# EasyEDA Pro project ax08_doc.eprj, board sequencer
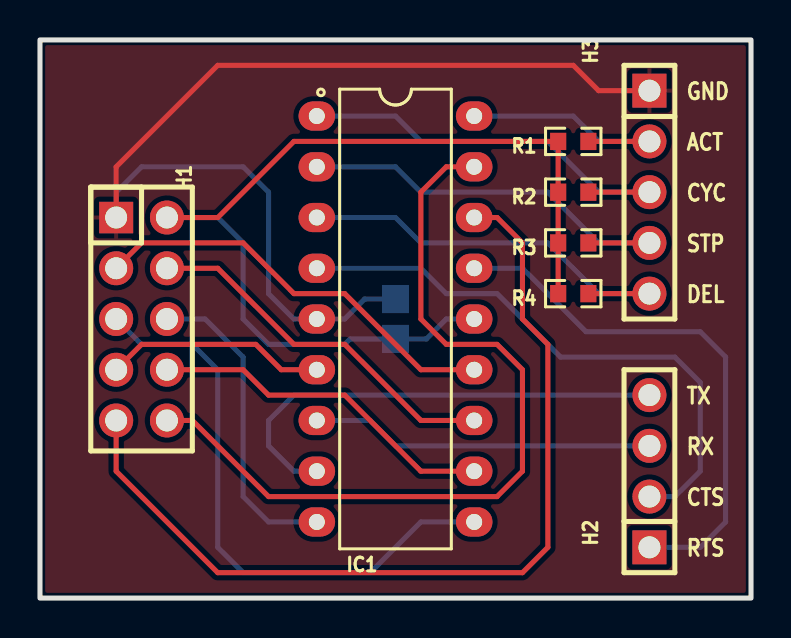
[diagram p26: board, top side]
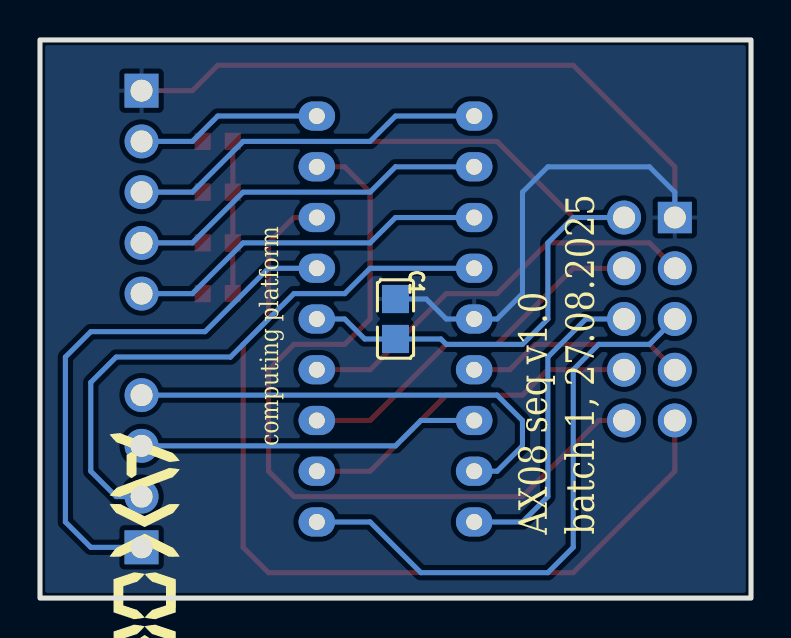
[diagram p27: board, bottom side, seen from below]

Outline 35.56 x 27.94 mm; copper layers: Top Layer, Bottom Layer. Coordinates in mm from the lower left corner of the outline.
Outline path: rectangle 0,27.94 35.56,0
Stack: Top Layer 0.035mm / Dielectric1 1.51mm FR4 er 4.5 / Bottom Layer 0.035mm

## Design rules (mm)
template: JLCPCB Capability(Two Layers Board)
spacing copperThickness1oz (default): track to track 0.102, other pairs 0.152 to 0.3
spacing copperThickness2oz: track to track 0.203, other pairs 0.152 to 0.3
track width copperThickness1oz (default): min 0.127, default 0.254, max 2.54
track width copperThickness2oz: min 0.203, default 0.254, max 2.54
differential pair differentialPair (default): width min 0.127, default 0.254, max 2.54; gap min 0.152, default 0.152
via viaSize (default): diameter min 0.5, default 0.61, max 10; hole min 0.3, default 0.305, max 6.3

## Placement (name value [footprint] x y rotation side)
C1  100nF  [C0805]  17.78 13.97 270 bottom
H1  PM254V-12-10P-H85  [HDR-TH_10P-P2.54-V-F-R2-C5-S2.54]  5.08 13.97 270 top
H2  PZ254V-11-04P  [HDR-TH_4P-P2.54-V-M]  30.48 6.35 90 top
H3  PZ254V-11-05P  [HDR-TH_5P-P2.54-V-M]  30.48 20.32 270 top
IC1  PIC16F1847-I/P  [PDIP-18_L22.9-W6.4-P2.54-LS7.9-BL]  17.78 13.97 270 top
R1  10kΩ  [R0603]  26.67 22.86 180 top
R2  10kΩ  [R0603]  26.67 20.32 180 top
R3  10kΩ  [R0603]  26.67 17.78 180 top
R4  10kΩ  [R0603]  26.67 15.24 180 top

## Footprints (pads in the part's own frame, mm; a bottom-side part is the same pattern mirrored in y, then rotated)
C0805
  rect 1.41x1.35 smd: 1(-1,0) 2(1,0)
HDR-TH_4P-P2.54-V-M
  rect 1.7x1.7 hole 1.1: 1(-3.81,0)
  round 1.7 hole 1.1: 2(-1.27,0) 3(1.27,0) 4(3.81,0)
HDR-TH_5P-P2.54-V-M
  rect 1.7x1.7 hole 1.1: 1(-5.08,0)
  round 1.7 hole 1.1: 2(-2.54,0) 3(0,0) 4(2.54,0) 5(5.08,0)
HDR-TH_10P-P2.54-V-F-R2-C5-S2.54
  rect 1.575x1.7 hole 1.1: 1(-5.08,-1.27)
  round 1.7 hole 1.1: 2(-5.08,1.27) 3(-2.54,-1.27) 4(-2.54,1.27) 5(0,-1.27) 6(0,1.27) 7(2.54,-1.27) 8(2.54,1.27) 9(5.08,-1.27) 10(5.08,1.27)
PDIP-18_L22.9-W6.4-P2.54-LS7.9-BL
  oval 1.462x1.827 hole 0.8: 1(-10.16,-3.935) 2(-7.62,-3.935) 3(-5.08,-3.935) 4(-2.54,-3.935) 5(0,-3.935) 6(2.54,-3.935) 7(5.08,-3.935) 8(7.62,-3.935) 9(10.16,-3.935) 10(10.16,3.935) 11(7.62,3.935) 12(5.08,3.935) 13(2.54,3.935) 14(0,3.935) 15(-2.54,3.935) 16(-5.08,3.935) 17(-7.62,3.935) 18(-10.16,3.935)
R0603
  rect 0.806x0.864 smd: 1(-0.753,0) 2(0.753,0)

## Nets
As in the schematic.

## Routing (per net, layer and track width the routed paths; a pad name or vN(x,y) marks a point on that pad's centre or on a via; arc(x,y) is an arc through that point)
+5V: length 49.5
  Top Layer w0.254: H1.2 8.89,19.05 12.7,22.86 R1.2 R2.2 R3.2 R4.2
  Bottom Layer w0.254: IC1.14 20.32,13.97 19.32,12.97 C1.2 15.51,12.97 15.24,12.7 11.43,12.7 10.16,13.97 10.16,17.78 8.89,19.05 H1.2
GND: length 54.2
  Top Layer w0.254: H1.1 3.81,21.59 8.89,26.67 26.67,26.67 27.94,25.4 H3.1
  Bottom Layer w0.254: H1.1 3.81,20.32 5.08,21.59 10.16,21.59 11.43,20.32 11.43,15.24 12.7,13.97 IC1.5 15.24,13.97 16.24,14.97 C1.1
ACTION: length 12.3
  Top Layer w0.254: H3.2 R1.1
  Bottom Layer w0.254: IC1.18 26.67,24.13 27.94,22.86 H3.2
AD_RGSET_OVERRIDE: length 18.5
  Top Layer w0.254: H1.4 8.89,16.51 12.7,12.7 15.24,12.7 19.05,8.89 IC1.12
CTS: length 29.1
  Bottom Layer w0.254: H2.2 31.75,5.08 33.02,6.35 33.02,10.8 31.75,12.06 26.03,12.06 22.86,15.24 20.32,15.24 19.05,16.51 IC1.4
CYCLE: length 21.3
  Top Layer w0.254: H3.3 R2.1
  Bottom Layer w0.254: IC1.1 17.78,24.13 19.05,22.86 25.4,22.86 27.94,20.32 H3.3
DELAY: length 21.3
  Top Layer w0.254: H3.5 R4.1
  Bottom Layer w0.254: H3.5 27.94,15.24 25.4,17.78 19.05,17.78 17.78,19.05 IC1.3
FREEZE_OP: length 29.4
  Bottom Layer w0.254: IC1.10 19.05,3.81 16.51,1.27 10.16,1.27 8.89,2.54 8.89,11.43 7.62,12.7 5.08,12.7 H1.5
FREEZE_WRD: length 15.8
  Bottom Layer w0.254: IC1.9 11.43,3.81 10.16,5.08 10.16,12.06 8.25,13.97 H1.6
HOLD: length 17.5
  Top Layer w0.254: H1.8 10.16,11.43 11.43,10.16 15.24,10.16 19.05,6.35 IC1.11
MODE: length 40.6
  Top Layer w0.254: IC1.17 20.32,21.59 19.05,20.32 19.05,13.97 20.32,12.7 22.86,12.7 24.13,11.43 24.13,6.35 22.86,5.08 11.43,5.08 7.62,8.89 H1.10
NOT_OPCD_11111: length 45.5
  Top Layer w0.254: IC1.16 22.86,19.05 24.13,17.78 24.13,13.97 25.4,12.7 25.4,2.54 24.13,1.27 8.89,1.27 3.81,6.35 H1.9
PC_SOURCE_INC: length 11.1
  Top Layer w0.254: H1.7 5.08,12.7 10.79,12.7 12.06,11.43 IC1.6
RTS: length 27
  Bottom Layer w0.254: IC1.15 24.13,16.51 27.31,13.33 33.02,13.33 34.29,12.06 34.29,3.81 33.02,2.54 H2.1
RX: length 17.2
  Bottom Layer w0.254: H2.3 17.78,7.62 16.51,8.89 IC1.7
STEP: length 21.3
  Top Layer w0.254: H3.4 R3.1
  Bottom Layer w0.254: H3.4 27.94,17.78 25.4,20.32 19.05,20.32 17.78,21.59 IC1.2
STORE: length 21.1
  Top Layer w0.254: IC1.13 19.05,11.43 15.24,15.24 12.7,15.24 10.16,17.78 5.08,17.78 H1.3
TX: length 23.8
  Bottom Layer w0.254: H2.4 12.7,10.16 11.43,8.89 11.43,7.62 12.7,6.35 IC1.8

## Copper pours and planes (outline as drawn; the poured copper is in the pictures)
GND on Top Layer: 0,27.94 35.56,27.94 35.56,0 0,0
GND on Bottom Layer: 0,27.94 35.56,27.94 35.56,0 0,0

## Text on the board
Bottom Silkscreen Layer: computing platform | AX08 seq v1.0 / batch 1, 27.08.2025
Top Silkscreen Layer: GND | ACT | CYC | STP | DEL | TX | RX | CTS | RTS
